# Altium schematic sheet 100068622_data_switches.SchDoc
size 863 x 558 mm; SheetNumber: 2; SheetTotal: 6
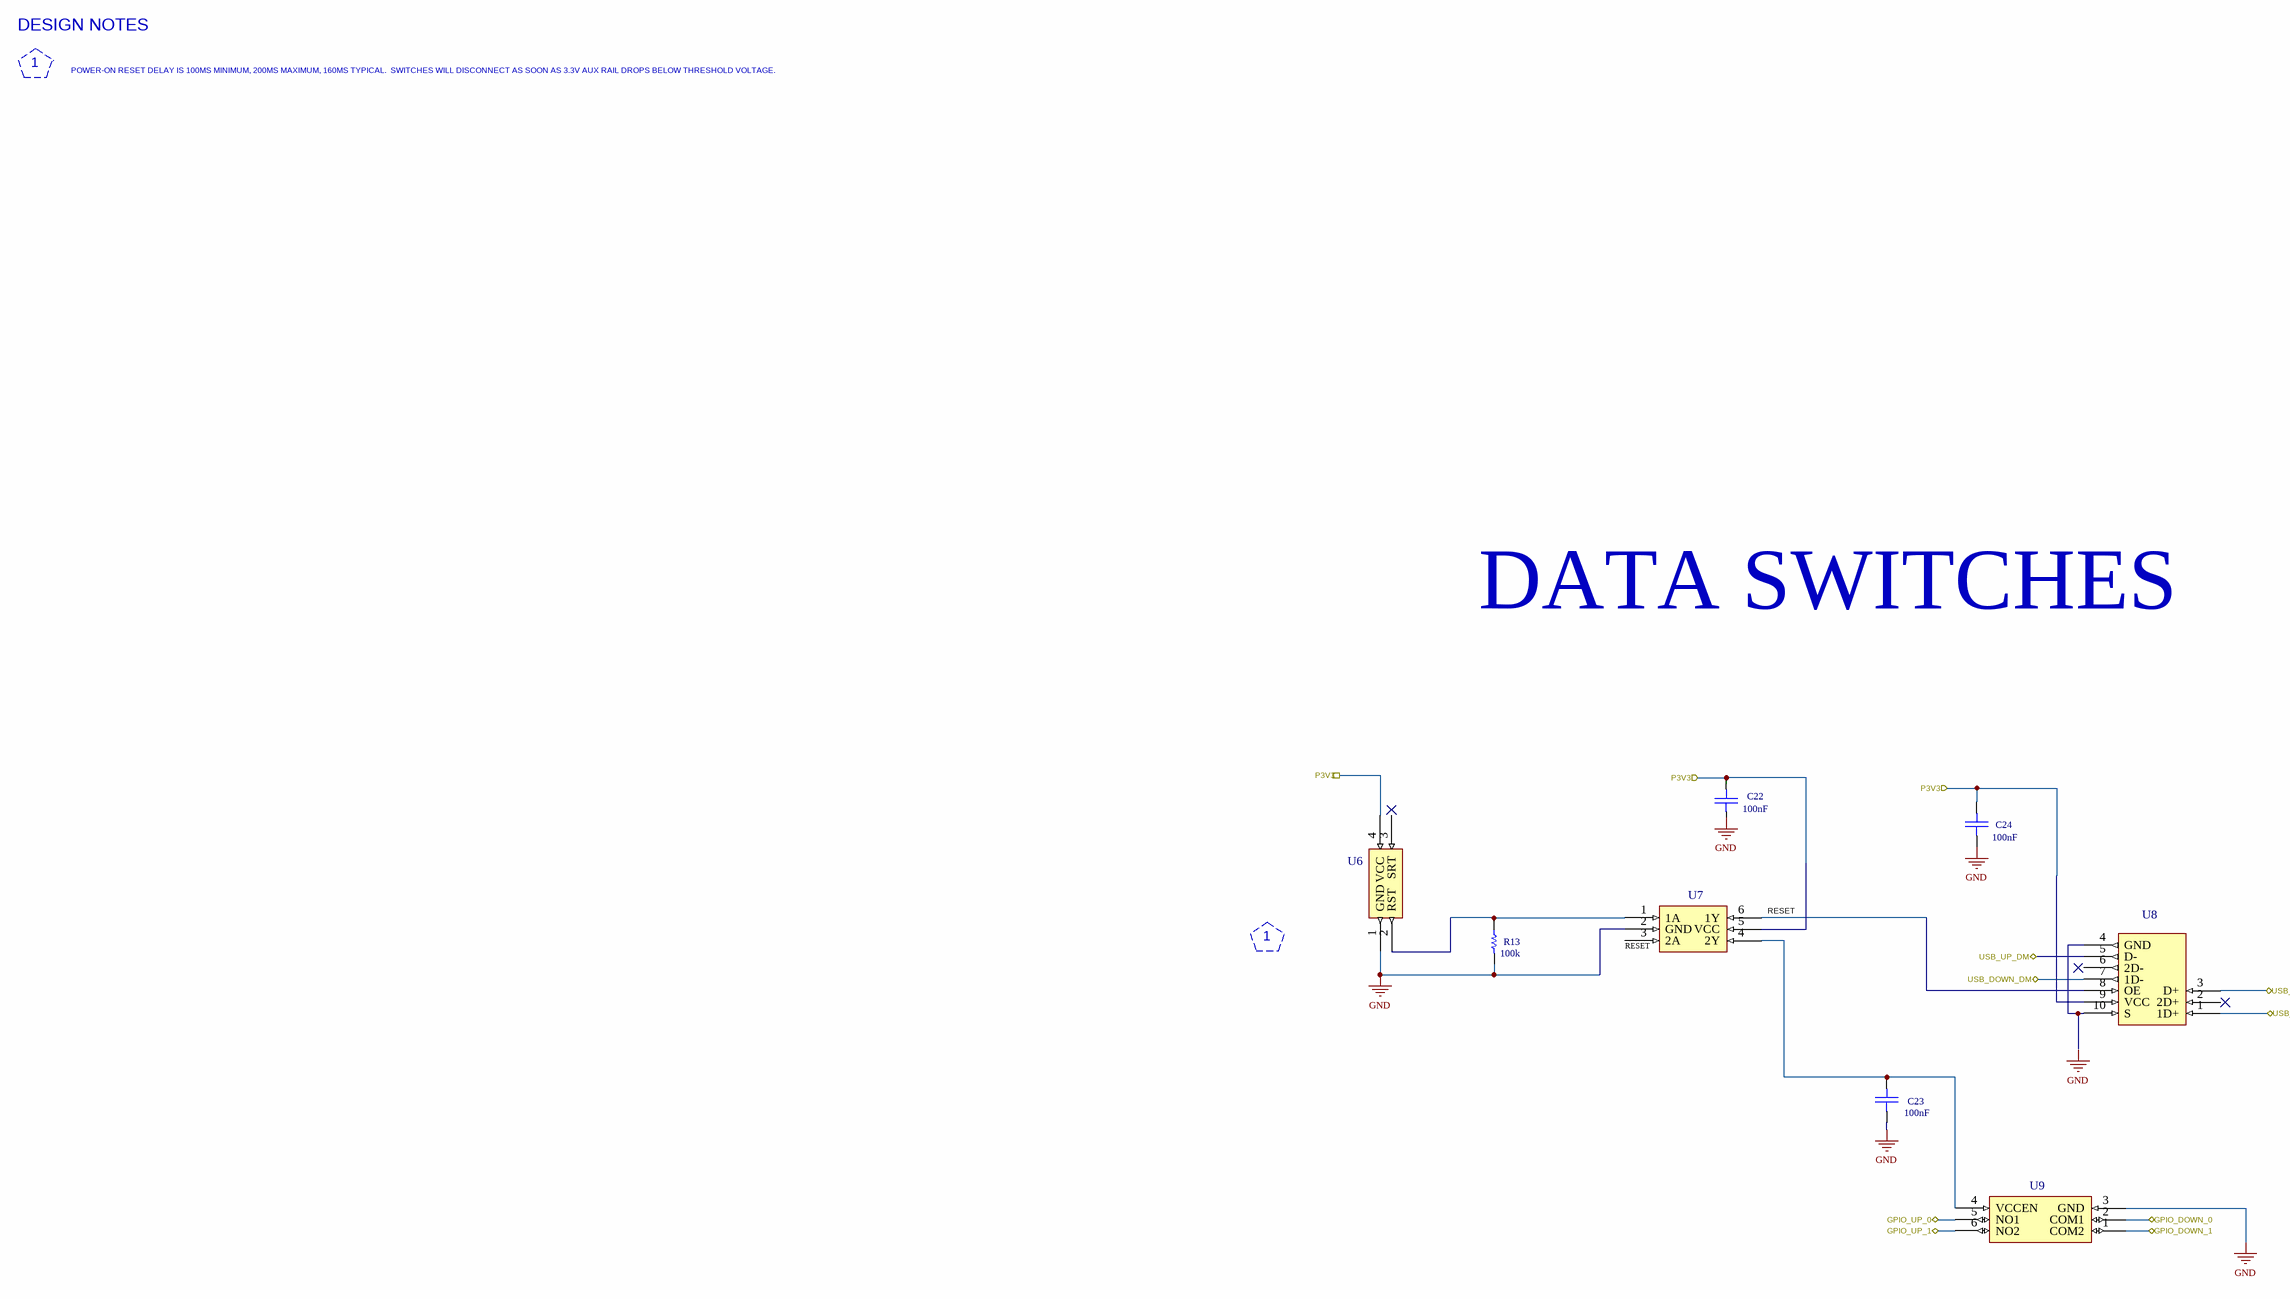
[diagram p0: 100068622_data_switches.SchDoc]

## Parts
C22  value 100nF  [CAP-0402-A]  (hidden comment: CAP 0402 0.1UF 50V 10% X5R)
C23  value 100nF  [CAP-0402-A]  (hidden comment: CAP 0402 0.1UF 50V 10% X5R)
C24  value 100nF  [CAP-0402-A]  (hidden comment: CAP 0402 0.1UF 50V 10% X5R)
R13  value 100k  [RES-0402-C]  (hidden comment: Res 0402 100K 1/10W 1% Thick Flim)
U6  MAX821UUS+T  [IC-SOT143-4-A]  (value not drawn)
U7  SN74AUP2G04DRYR  [IC-SON6-A]  (value not drawn)
U8  TC7USB40MU  [IC-UQFN10-A]  (value not drawn)
U9  MAX20336AEFT+T  [IC-FC2QFN-A]  (value not drawn)

## Ports
GPIO_DOWN_0 (bidir), GPIO_DOWN_1 (bidir), GPIO_UP_0 (bidir), GPIO_UP_1 (bidir), P3V3 (in), USB_DOWN_DM (bidir), USB_DOWN_DP (bidir), USB_UP_DM (bidir), USB_UP_DP (bidir)

## Nets
GND: C23.1 C24.1 R13.1 U6.1(GND) U7.2(GND) U9.3(GND)
GPIO_DOWN_0: U9.2(COM1) ; port GPIO_DOWN_0
GPIO_DOWN_1: U9.1(COM2) ; port GPIO_DOWN_1
GPIO_UP_0: U9.5(NO1) ; port GPIO_UP_0
GPIO_UP_1: U9.6(NO2) ; port GPIO_UP_1
P3V3: C22.1 C24.2 U7.5(VCC) U8.9(VCC) ; port P3V3
USB_DOWN_DM: U8.7(1D-) ; port USB_DOWN_DM
USB_DOWN_DP: U8.1(1D+) ; port USB_DOWN_DP
USB_UP_DP: U8.3(D+) ; port USB_UP_DP
NetC23_2: C23.2 U7.4(2Y) U9.4(VCCEN)
NetR13_2: R13.2 U6.2(RST) U7.1(1A)
NetU7_6: U7.6(1Y) U8.8(OE)
NetU8_4: U8.4(GND) U8.10(S)

Not connected (* = marked no-connect by the designer): C22 2; U6 3(SRT) 4(VCC); U7 3(2A); U8 2(2D+) 5(D-) 6(2D-)

## Notes on the sheet
- DESIGN NOTES
- 1
- POWER-ON RESET DELAY IS 100MS MINIMUM, 200MS MAXIMUM, 160MS
  TYPICAL.  SWITCHES WILL DISCONNECT AS SOON AS 3.3V AUX RAIL
  DROPS BELOW THRESHOLD VOLTAGE.
- DATA SWITCHES
- Labels drawn without touching a wire or pin: GND, RESET
- DWG NO
- REVISIONS
- SH
- REVISION
- DESCRIPTION
- DATE(YEAR-MO-DA)
- APPROVED
- PART NO.
- DESIGN ACTIVITY
- US ARMY
  COMBAT CAPABILITIES DEVELOPMENT COMMAND ARMAMENTS CENTER
  PICATINNY ARSENAL, NEW JERSEY 07806-5000
- SIZE
- CAGE CODE
- DWG NO.
- D
- 19200
- SCALE
- NONE
- UNIT WT.
- ---
- SHEET

## Library data of the parts
C22-C24 = CAP-00349-1: Capacitor Type: Ceramic; Leader Qty: 100; UOM: EA; Footprint: Capacitor_SMD:C_0402_1005Metric; Case/Package: 0402; Max Operating Temperature: 85°C; Min Operating Temperature: -55°C; Mounting Technology: Surface Mount; Pins: 2; RoHS Compliant: Yes; Tolerance: 10%; Voltage Rating: 50V
R13 = RES-00031-9: Leader Qty: 100; Footprint: Resistor_SMD:R_0402_1005Metric; Case/Package: 0402; Max Operating Temperature: 155°C; Min Operating Temperature: -55°C; Mounting Technology: SMT; Pins: 2; RoHS Compliant: Yes; Tolerance: 1%
U6 = IC-00421-1: 4-Pin, µP Voltage Monitors with Pin-Selectable Power-On Reset Timeout Delay; Manufacturer Lifecycle Status: PRODUCTION; Max Power Dissipation: 320mW; Max Reset Threshold Voltage: 2.81V; Max Supply Current: 5.5µA; Max Supply Voltage: 5.5V; Min Reset Threshold Voltage: 2.74V; Min Supply Voltage: 1V; Nominal Supply Current: 1.8µA; Number of Outputs: 1; Output Current: 20mA; Reset: Active Low; Threshold Voltage: 2.78V; Watchdog Timer: No; Footprint: 1a_Misc:SOT-143 Maxim; Case/Package: SOT-143-4; Height: 1.22mm; Lead Free: Lead Free; Lifecycle Status: Production; Max Operating Temperature: 125°C; Min Operating Temperature: -40°C; Mounting Technology: Surface Mount; Number of Voltages Monitored: 1; Operating Supply Current: 5.5µA; Overvoltage Threshold: 2.81V; Pins: 4; Radiation Hardening: No; RoHS: Compliant; Type: Simple Reset/Power-On Reset; Undervoltage Threshold: 2.74V
U7 = IC-00422-1: IC INVERTER 2CH 2-INP 6SON Inverter IC 2 Channel 6-SON (1.45x1); Manufacturer Lifecycle Status: ACTIVE; High Level Output Current: -4mA; Logic Function: Buffer, Inverter; Low Level Output Current: 4mA; Max Supply Voltage: 3.6V; Min Supply Voltage: 800mV; Number of Bits: 2; Number of Inputs: 1; Propagation Delay: 6.2ns; Quiescent Current: 500nA; Turn-On Delay Time: 25.5ns; Footprint: 1a_Misc:QFN-6_1.4x1mm_P0.5mm TI DRY6; Height: 600µm; Lead Free: Lead Free; Length: 1.45mm; Lifecycle Status: Production; Max Operating Temperature: 85°C; Min Operating Temperature: -40°C; Mounting Technology: Surface Mount; Number of Circuits: 2; Number of Elements: 2; Number of Gates: 2; Packaging: Digi-Reel®; Pins: 6; Radiation Hardening: No; RoHS: Compliant; Thickness: 500µm; Width: 1mm
U8 = IC-00423-1: USB Interface, 1: 2 Multiplexer/Demultiplexer Switch, USB 2.0, 2.3 V, 4.3 V, UQFN-B, 10 Pins; Footprint: 1a_Misc:Toshiba UQFN-10_1.4x1.8mm_P0.4mm; Schedule B: 8542390000
U9 = IC-00417-1: Industry's Smallest DPST Can Switch ±5.5V Signals with a Single VCC as Low as 1.6V; Manufacturer Lifecycle Status: PRODUCTION; Footprint: 1a_Misc:FC2QFN-6; Lifecycle Status: Production; RoHS: Compliant